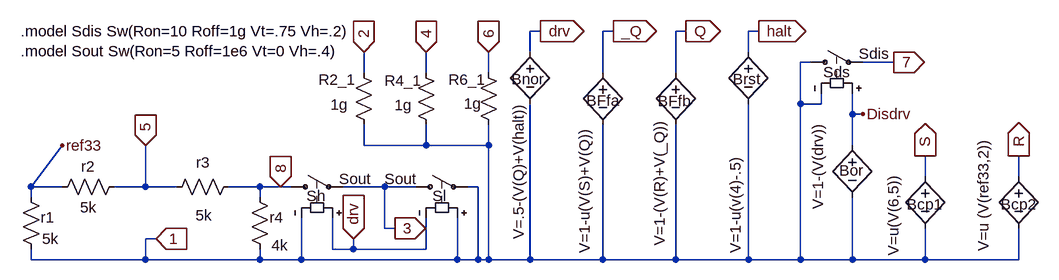
[diagram p0: schematic 7B3Sw555.asc]
7B3Sw555.asc, the LTspice schematic file:
Version 4
SHEET 1 1152 916
WIRE -784 528 -784 512
WIRE -784 624 -784 608
WIRE -736 448 -784 512
WIRE -736 512 -784 512
WIRE -608 512 -656 512
WIRE -608 512 -608 448
WIRE -608 624 -784 624
WIRE -608 624 -608 592
WIRE -592 592 -608 592
WIRE -560 512 -608 512
WIRE -432 512 -480 512
WIRE -432 528 -432 512
WIRE -432 624 -608 624
WIRE -432 624 -432 608
WIRE -400 512 -432 512
WIRE -384 512 -400 512
WIRE -368 624 -432 624
WIRE -368 624 -368 560
WIRE -320 608 -320 560
WIRE -288 608 -320 608
WIRE -288 608 -288 592
WIRE -272 336 -272 304
WIRE -272 448 -272 416
WIRE -240 512 -304 512
WIRE -240 576 -240 512
WIRE -224 576 -240 576
WIRE -192 512 -240 512
WIRE -176 336 -176 304
WIRE -176 448 -272 448
WIRE -176 448 -176 416
WIRE -176 608 -288 608
WIRE -176 608 -176 560
WIRE -128 624 -368 624
WIRE -128 624 -128 560
WIRE -96 512 -112 512
WIRE -96 624 -128 624
WIRE -96 624 -96 512
WIRE -80 336 -80 304
WIRE -80 448 -176 448
WIRE -80 448 -80 416
WIRE -80 624 -96 624
WIRE -80 624 -80 448
WIRE -16 304 -16 272
WIRE -16 624 -80 624
WIRE -16 624 -16 384
WIRE 0 272 -16 272
WIRE 96 336 96 272
WIRE 96 624 -16 624
WIRE 96 624 96 416
WIRE 112 272 96 272
WIRE 208 336 208 272
WIRE 208 624 96 624
WIRE 208 624 208 416
WIRE 224 272 208 272
WIRE 320 304 320 272
WIRE 320 624 208 624
WIRE 320 624 320 384
WIRE 336 272 320 272
WIRE 400 384 400 320
WIRE 400 624 320 624
WIRE 400 624 400 384
WIRE 416 320 400 320
WIRE 432 384 400 384
WIRE 432 384 432 368
WIRE 480 400 480 368
WIRE 480 448 480 400
WIRE 480 624 400 624
WIRE 480 624 480 528
WIRE 496 400 480 400
WIRE 544 320 496 320
WIRE 592 496 592 464
WIRE 592 624 480 624
WIRE 592 624 592 576
WIRE 736 496 736 464
WIRE 736 624 592 624
WIRE 736 624 736 576
FLAG -736 448 ref33
FLAG -608 448 5
IOPIN -608 448 In
FLAG 544 320 7
IOPIN 544 320 Out
FLAG 496 400 Disdrv
FLAG -400 512 8
IOPIN -400 512 In
FLAG -224 576 3
IOPIN -224 576 Out
FLAG -288 592 drv
IOPIN -288 592 In
FLAG -592 592 1
IOPIN -592 592 In
FLAG -176 304 4
IOPIN -176 304 In
FLAG -80 304 6
IOPIN -80 304 In
FLAG 592 464 S
IOPIN 592 464 Out
FLAG -272 304 2
IOPIN -272 304 In
FLAG 736 464 R
IOPIN 736 464 Out
FLAG 0 272 drv
IOPIN 0 272 Out
FLAG 112 272 _Q
IOPIN 112 272 Out
FLAG 224 272 Q
IOPIN 224 272 Out
FLAG 336 272 halt
IOPIN 336 272 Out
SYMBOL res -800 512 R0
WINDOW 0 31 47 Left 0
WINDOW 3 33 80 Left 0
SYMATTR InstName r1
SYMATTR Value 5k
SYMBOL res -640 496 R90
WINDOW 0 0 56 VBottom 0
WINDOW 3 32 56 VTop 0
SYMATTR InstName r2
SYMATTR Value 5k
SYMBOL res -464 496 R90
WINDOW 0 -6 55 VBottom 0
WINDOW 3 44 54 VTop 0
SYMATTR InstName r3
SYMATTR Value 5k
SYMBOL sw 400 320 R270
WINDOW 0 -15 35 VRight 0
WINDOW 3 13 90 VRight 0
SYMATTR InstName Sds
SYMATTR Value Sdis
SYMBOL sw -400 512 R270
WINDOW 0 -14 40 VRight 0
WINDOW 3 12 90 VRight 0
SYMATTR InstName Sh
SYMATTR Value Sout
SYMBOL sw -208 512 R270
WINDOW 0 -14 42 VRight 0
WINDOW 3 12 -32 VRight 0
SYMATTR InstName Sl
SYMATTR Value Sout
SYMBOL res -448 512 R0
WINDOW 0 31 47 Left 0
WINDOW 3 34 90 Left 0
SYMATTR InstName r4
SYMATTR Value 4k
SYMBOL res -256 432 R180
WINDOW 0 28 85 Left 0
WINDOW 3 40 47 Left 0
SYMATTR InstName R2_1
SYMATTR Value 1g
SYMBOL bv 592 480 R0
WINDOW 0 -28 59 Left 0
WINDOW 3 -49 139 VLeft 0
SYMATTR InstName Bcp1
SYMATTR Value V=u(V(6,5))
SYMBOL bv 736 480 R0
WINDOW 0 -28 59 Left 0
WINDOW 3 -54 -43 VRight 0
SYMATTR InstName Bcp2
SYMATTR Value V=u (V(ref33,2))
SYMBOL bv 480 432 R0
WINDOW 0 -20 55 Left 0
WINDOW 3 -53 -19 VRight 0
SYMATTR InstName Bor
SYMATTR Value V=1-(V(drv))
SYMBOL bv -16 288 R0
WINDOW 0 -29 58 Left 0
WINDOW 3 -18 94 VRight 0
SYMATTR InstName Bnor
SYMATTR Value V=.5-(V(Q)+V(halt))
SYMBOL bv 96 320 R0
WINDOW 0 -25 59 Left 0
WINDOW 3 -28 100 VRight 0
SYMATTR InstName BFfa
SYMATTR Value V=1-u(V(S)+V(Q))
SYMBOL bv 208 320 R0
WINDOW 0 -27 60 Left 0
WINDOW 3 -25 87 VRight 0
SYMATTR InstName BFfb
SYMATTR Value V=1-(V(R)+V(_Q))
SYMBOL bv 320 288 R0
WINDOW 0 -24 58 Left 0
WINDOW 3 -20 327 VLeft 0
SYMATTR InstName Brst
SYMATTR Value V=1-u(v(4)-.5)
SYMBOL res -96 320 R0
WINDOW 0 12 27 Right 0
WINDOW 3 -22 64 Left 0
SYMATTR InstName R6_1
SYMATTR Value 1g
SYMBOL res -192 320 R0
WINDOW 0 10 28 Right 0
WINDOW 3 -33 66 Left 0
SYMATTR InstName R4_1
SYMATTR Value 1g
TEXT -800 272 Left 0 !.model Sdis Sw(Ron=10 Roff=1g Vt=.75 Vh=.2)\n.model Sout Sw(Ron=5 Roff=1e6 Vt=0 Vh=.4)

The netlist it stands for:
* 7B3Sw555.asc
r1 ref33 1 5k
r2 5 ref33 5k
r3 8 5 5k
Sds 1 7 Disdrv 1 Sdis
Sh 8 3 drv 1 Sout
Sl 3 1 1 drv Sout
r4 8 1 4k
R2_1 1 2 1g
Bcp1 S 1 V=u(V(6,5))
Bcp2 R 1 V=u (V(ref33,2))
Bor Disdrv 1 V=1-(V(drv))
Bnor drv 1 V=.5-(V(Q)+V(halt))
BFfa _Q 1 V=1-u(V(S)+V(Q))
BFfb Q 1 V=1-(V(R)+V(_Q))
Brst halt 1 V=1-u(v(4)-.5)
R6_1 6 1 1g
R4_1 4 1 1g
.model Sdis Sw(Ron=10 Roff=1g Vt=.75 Vh=.2)
.model Sout Sw(Ron=5 Roff=1e6 Vt=0 Vh=.4)
.backanno
.end